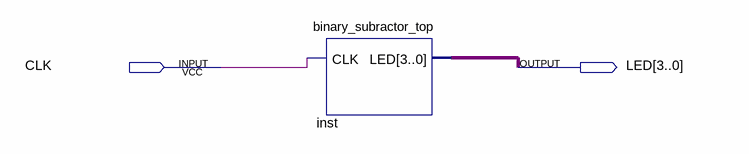
[diagram p0: schematic sheet]
// Quartus schematic lab13_6.bdf as structural Verilog: 1 symbols, 2 pins
module lab13_6 (
  input  CLK,
  output [3:0] LED
);

  binary_subractor_top inst (.CLK(CLK), .LED(LED));
endmodule
